# EAGLE design bsom-rs232-v002 (EAGLE 9.6.2)
Assembly variants: PROTOTYPE, PRODUCTION
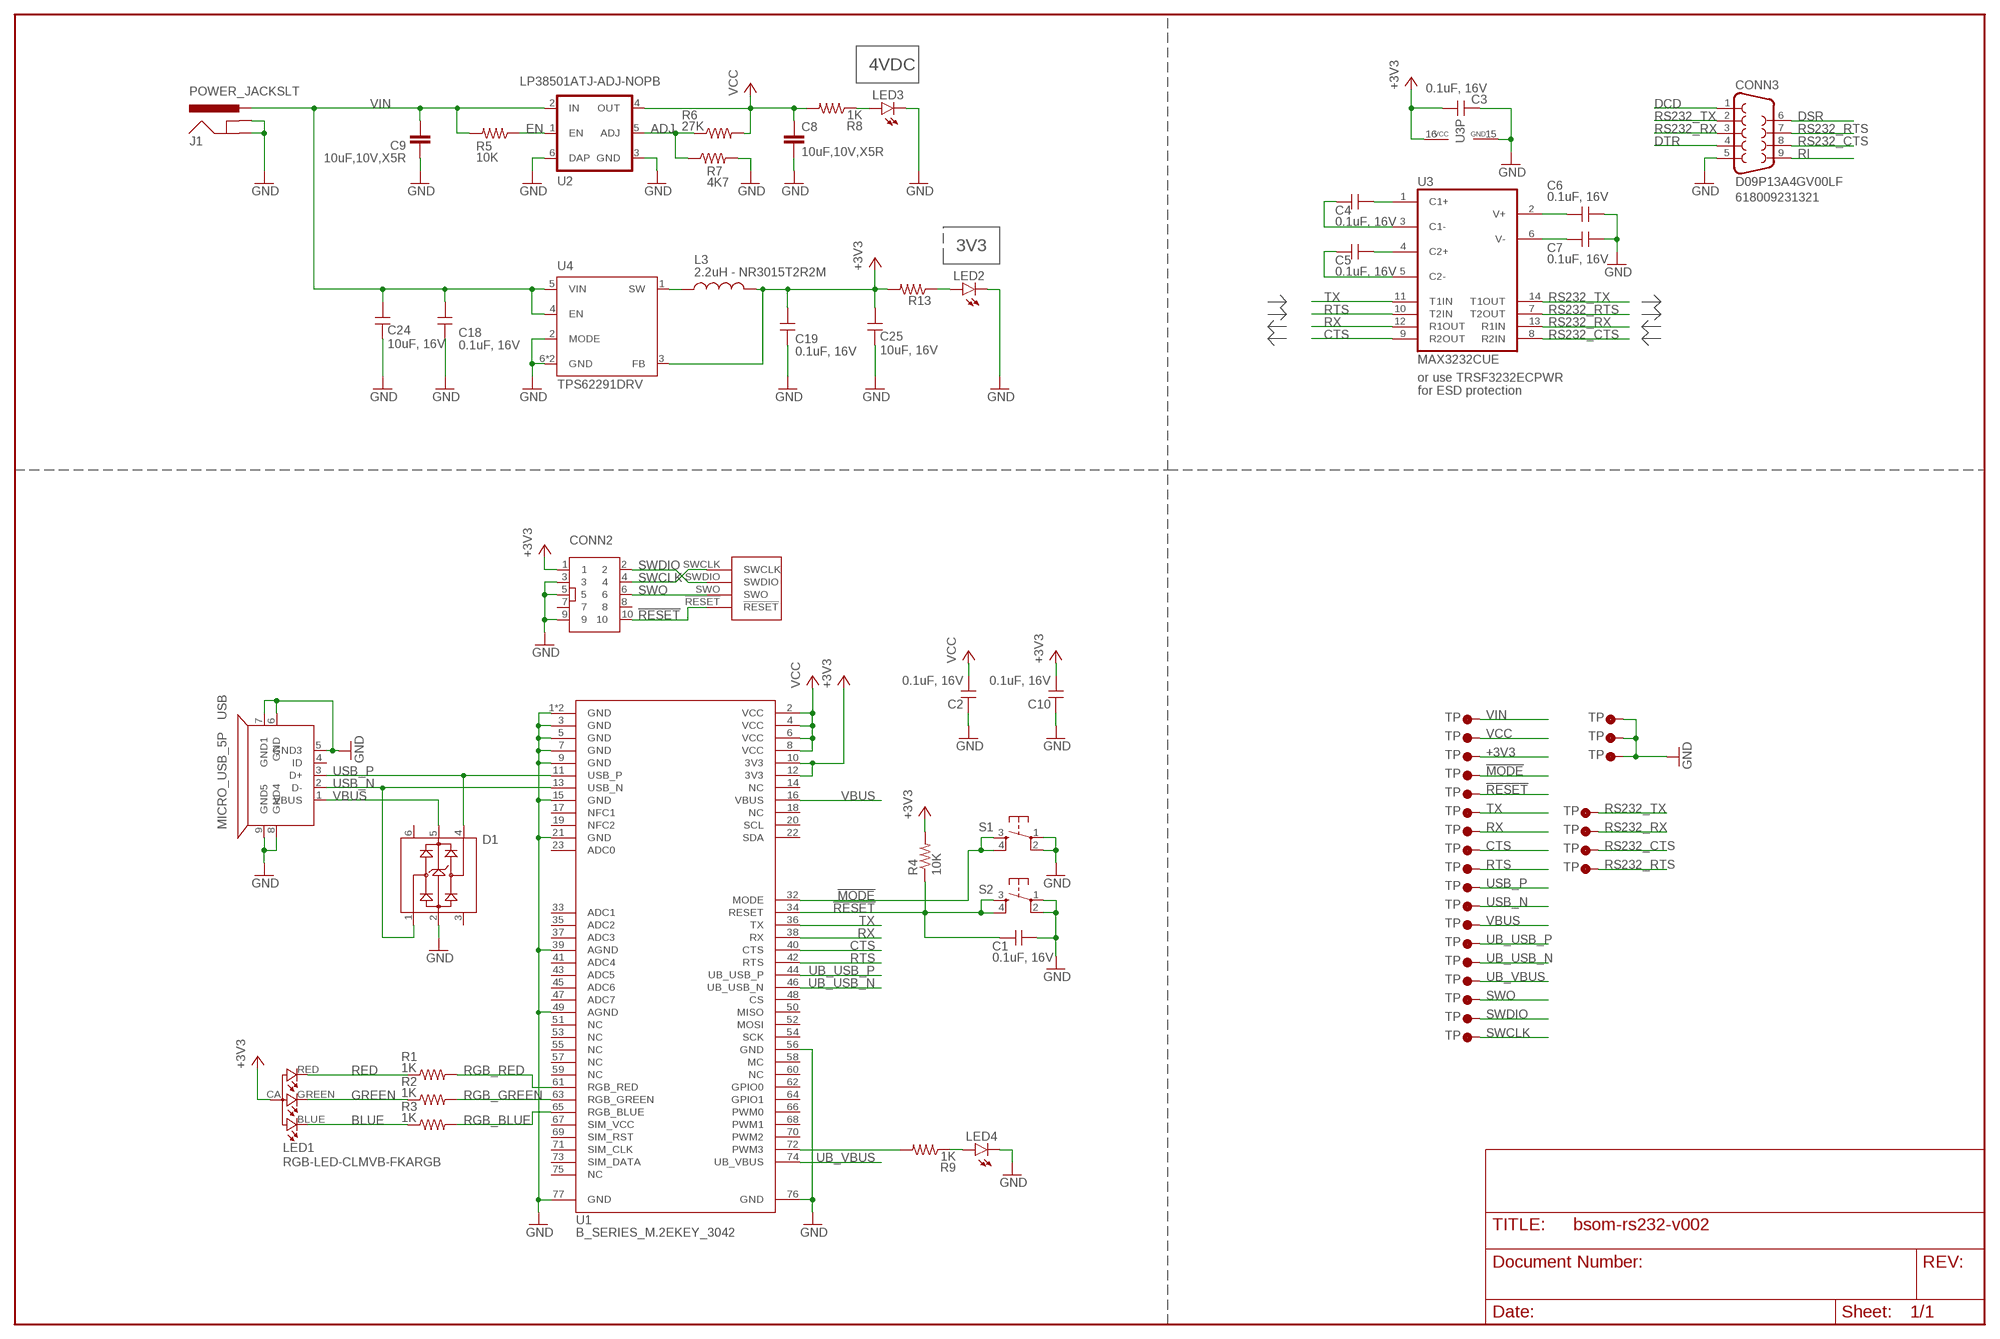
[diagram p0: schematic, sheet 1]

## Parts
C1  0.1uF, 16V  CAP_0.1UF_16V_0603  [C0603_P]  (not fitted in variant PRODUCTION)
C2  0.1uF, 16V  CAP_0.1UF_16V_0603  [C0603_P]
C3  0.1uF, 16V  CAP_0.1UF_16V_0603  [C0603_P]
C4  0.1uF, 16V  CAP_0.1UF_16V_0603  [C0603_P]
C5  0.1uF, 16V  CAP_0.1UF_16V_0603  [C0603_P]
C6  0.1uF, 16V  CAP_0.1UF_16V_0603  [C0603_P]
C7  0.1uF, 16V  CAP_0.1UF_16V_0603  [C0603_P]
C8  10uF,10V,X5R  C-EUC1206  [C1206]
C9  10uF,10V,X5R  C-EUC1206  [C1206]
C10  0.1uF, 16V  CAP_0.1UF_16V_0603  [C0603_P]
C18  0.1uF, 16V  CAP_0.1UF_16V_0603  [C0603_P]
C19  0.1uF, 16V  CAP_0.1UF_16V_0603  [C0603_P]
C24  10uF, 16V  CAP_10UF_16V_0603  [C0603_P]
C25  10uF, 16V  CAP_10UF_16V_0603  [C0603_P]
CONN2  CONN5X2  [CONN5X2_1.27]  (not fitted in variant PRODUCTION)
CONN3  D09P13A4GV00LF  F09HP  [F09HP]
D1  MAX3207EAUT+T  [SOT23-6]  (not fitted in variant PRODUCTION)
J1  POWER_JACKSLT  [POWER_JACK_SLOT]
L3  2.2uH - NR3015T2R2M  INDUCTOR-SPARKFUNNR3015T4R7M  [INDUCTOR-NR3015]
LED1  RGB-LED-CLMVB-FKARGB  [PLCC4-2MM-RGB]  (not fitted in variant PRODUCTION)
LED2  LEDCHIP-LED0603  [CHIP-LED0603]  (not fitted in variant PRODUCTION)
LED3  LEDCHIP-LED0603  [CHIP-LED0603]  (not fitted in variant PRODUCTION)
LED4  LEDCHIP-LED0603  [CHIP-LED0603]
R1  1K  RES_1K_0603  [R0603_P]  (not fitted in variant PRODUCTION)
R2  1K  RES_1K_0603  [R0603_P]  (not fitted in variant PRODUCTION)
R3  1K  RES_1K_0603  [R0603_P]  (not fitted in variant PRODUCTION)
R4  10K  RES_10K_0603  [R0603_P]  (not fitted in variant PRODUCTION)
R5  10K  RES_10K_0603  [R0603_P]
R6  27K  RES_0603  [R0603_P]
R7  4K7  RES_0603  [R0603_P]
R8  1K  RES_1K_0603  [R0603_P]  (not fitted in variant PRODUCTION)
R9  1K  RES_1K_0603  [R0603_P]
R13  RES_0603  [R0603_P]  (not fitted in variant PRODUCTION)
S1  TAC_SWITCHSMD  [TACTILE_SWITCH_SMD]  (not fitted in variant PRODUCTION)
S2  TAC_SWITCHSMD  [TACTILE_SWITCH_SMD]  (not fitted in variant PRODUCTION)
U1  B_SERIES_M.2EKEY_3042  [PARTICLE_M.2EKEY]
U2  LP38501ATJ-ADJ-NOPB  LP38501ATJ-ADJ-NOPBTI_NATIONAL_SEMICONDUCTOR_LP38501ATJ-ADJ-NOPB_0_0  [TI_NATIONAL_SEMICONDUCTOR_LP38501ATJ-ADJ-NOPB_0]
U3  MAX3232CUE  [TSSOP16]
U4  TPS62291DRV  [S-PWSON-N6]
U$1  TP5  [TP30_TOP]  (not fitted in variant PROTOTYPE)  (not fitted in variant PRODUCTION)
U$2  TP5  [TP30_TOP]  (not fitted in variant PROTOTYPE)  (not fitted in variant PRODUCTION)
U$3  TP5  [TP30_TOP]  (not fitted in variant PROTOTYPE)  (not fitted in variant PRODUCTION)
U$4  TP5  [TP30_TOP]  (not fitted in variant PROTOTYPE)  (not fitted in variant PRODUCTION)
U$5  TP5  [TP30_TOP]  (not fitted in variant PROTOTYPE)  (not fitted in variant PRODUCTION)
U$6  TP5  [TP30_TOP]  (not fitted in variant PROTOTYPE)  (not fitted in variant PRODUCTION)
U$7  TP5  [TP30_TOP]  (not fitted in variant PROTOTYPE)  (not fitted in variant PRODUCTION)
U$8  TP5  [TP30_TOP]  (not fitted in variant PROTOTYPE)  (not fitted in variant PRODUCTION)
U$9  TP5  [TP30_TOP]  (not fitted in variant PROTOTYPE)  (not fitted in variant PRODUCTION)
U$10  TP5  [TP30_TOP]  (not fitted in variant PROTOTYPE)  (not fitted in variant PRODUCTION)
U$11  TP5  [TP30_TOP]  (not fitted in variant PROTOTYPE)  (not fitted in variant PRODUCTION)
U$12  TP5  [TP30_TOP]  (not fitted in variant PROTOTYPE)  (not fitted in variant PRODUCTION)
U$13  TP5  [TP30_TOP]  (not fitted in variant PROTOTYPE)  (not fitted in variant PRODUCTION)
U$14  TP5  [TP30_TOP]  (not fitted in variant PROTOTYPE)  (not fitted in variant PRODUCTION)
U$15  TP5  [TP30_TOP]  (not fitted in variant PROTOTYPE)  (not fitted in variant PRODUCTION)
U$16  TP5  [TP30_TOP]  (not fitted in variant PROTOTYPE)  (not fitted in variant PRODUCTION)
U$17  TP5  [TP30_TOP]  (not fitted in variant PROTOTYPE)  (not fitted in variant PRODUCTION)
U$18  TP5  [TP30_TOP]  (not fitted in variant PROTOTYPE)  (not fitted in variant PRODUCTION)
U$19  TP5  [TP30_TOP]  (not fitted in variant PROTOTYPE)  (not fitted in variant PRODUCTION)
U$20  TP5  [TP30_TOP]  (not fitted in variant PROTOTYPE)  (not fitted in variant PRODUCTION)
U$21  TP5  [TP30_TOP]  (not fitted in variant PROTOTYPE)  (not fitted in variant PRODUCTION)
U$22  TP5  [TP30_TOP]  (not fitted in variant PROTOTYPE)  (not fitted in variant PRODUCTION)
U$23  TP5  [TP30_TOP]  (not fitted in variant PROTOTYPE)  (not fitted in variant PRODUCTION)
U$24  TP5  [TP30_TOP]  (not fitted in variant PROTOTYPE)  (not fitted in variant PRODUCTION)
U$25  TP5  [TP30_TOP]  (not fitted in variant PROTOTYPE)  (not fitted in variant PRODUCTION)
USB  MICRO_USB_5P  MICRO_USBMICRO_USB  [MICRO_USB]  (not fitted in variant PRODUCTION)

## Nets
!MODE: S1.3 S1.4 U1.32(MODE) U$3.P$1(TP)
!RESET: C1.1 CONN2.10 R4.1 S2.3 S2.4 U1.34(RESET) U1.!RESET U$4.P$1(TP)
+3V3: C3.2 C10.1 C19.1 C25.1 CONN2.1 L3.2 LED1.CA R4.2 R13.2 U1.10(3V3) U1.12(3V3) U3.16(VCC) U4.3(FB) U$2.P$1(TP)
ADJ: R6.1 R7.1 U2.5(ADJ)
BLUE: LED1.BLUE R3.1
CTS: U1.40(CTS) U3.9(R2OUT) U$7.P$1(TP)
DCD: CONN3.1
DSR: CONN3.6
DTR: CONN3.4
EN: R5.1 U2.1(EN)
GND: C1.2 C2.2 C3.1 C6.1 C7.1 C8.2 C9.2 C10.2 C18.2 C19.2 C24.2 C25.2 CONN2.3 CONN2.5 CONN2.9 CONN3.5 D1.2 J1.GND@1(GNDBREAK) J1.GND@2(GND) LED2.C LED3.C LED4.C R7.2 S1.1 S1.2 S2.1 S2.2 U1.1(GND) U1.3(GND) U1.5(GND) U1.7(GND) U1.9(GND) U1.15(GND) U1.21(GND) U1.39(AGND) U1.49(AGND) U1.56(GND) U1.76(GND) U1.77(GND) U1.GND U2.3(GND) U2.6(DAP) U3.15(GND) U4.2(MODE) U4.6(GND) U4.TP(GND) U$23.P$1(TP) U$24.P$1(TP) U$25.P$1(TP) USB.5(GND3) USB.6(GND) USB.7(GND1) USB.8(GND4) USB.9(GND5)
GREEN: LED1.GREEN R2.1
N$2: L3.1 U4.1(SW)
N$3: LED3.A R8.1
N$5: R9.2 U1.72(PWM3)
N$6: LED4.A R9.1
N$10: C5.1 U3.4(C2+)
N$11: C4.1 U3.1(C1+)
N$12: C4.2 U3.3(C1-)
N$13: C5.2 U3.5(C2-)
N$14: C6.2 U3.2(V+)
N$15: C7.2 U3.6(V-)
N$20: LED2.A R13.1
RED: LED1.RED R1.1
RGB_BLUE: R3.2 U1.65(RGB_BLUE)
RGB_GREEN: R2.2 U1.63(RGB_GREEN)
RGB_RED: R1.2 U1.61(RGB_RED)
RI: CONN3.9
RS232_CTS: CONN3.8 U3.8(R2IN) U$21.P$1(TP)
RS232_RTS: CONN3.7 U3.7(T2OUT) U$22.P$1(TP)
RS232_RX: CONN3.3 U3.13(R1IN) U$20.P$1(TP)
RS232_TX: CONN3.2 U3.14(T1OUT) U$19.P$1(TP)
RTS: U1.42(RTS) U3.10(T2IN) U$8.P$1(TP)
RX: U1.38(RX) U3.12(R1OUT) U$6.P$1(TP)
SWCLK: CONN2.4 U1.SWCLK U$15.P$1(TP)
SWDIO: CONN2.2 U1.SWDIO U$16.P$1(TP)
SWO: CONN2.6 U1.SWO U$17.P$1(TP)
TX: U1.36(TX) U3.11(T1IN) U$5.P$1(TP)
UB_USB_N: U1.46(UB_USB_N) U$13.P$1(TP)
UB_USB_P: U1.44(UB_USB_P) U$12.P$1(TP)
UB_VBUS: U1.74(UB_VBUS) U$18.P$1(TP)
USB_N: D1.1 U1.13(USB_N) U$10.P$1(TP) USB.2(D-)
USB_P: D1.4 U1.11(USB_P) U$9.P$1(TP) USB.3(D+)
VBUS: D1.5 U1.16(VBUS) U$11.P$1(TP) USB.1(VBUS)
VCC: C2.1 C8.1 R6.2 R8.2 U1.2(VCC) U1.4(VCC) U1.6(VCC) U1.8(VCC) U2.4(OUT) U$1.P$1(TP)
VIN: C9.1 C18.1 C24.1 J1.PWR R5.2 U2.2(IN) U4.4(EN) U4.5(VIN) U$14.P$1(TP)
Unconnected: CONN2.7 CONN2.8 D1.3 D1.6 U1.14(NC) U1.17(NFC1) U1.18(NC) U1.19(NFC2) U1.20(SCL) U1.22(SDA) U1.23(ADC0) U1.33(ADC1) U1.35(ADC2) U1.37(ADC3) U1.41(ADC4) U1.43(ADC5) U1.45(ADC6) U1.47(ADC7) U1.48(CS) U1.50(MISO) U1.51(NC) U1.52(MOSI) U1.53(NC) U1.54(SCK) U1.55(NC) U1.57(NC) U1.58(MC) U1.59(NC) U1.60(NC) U1.62(GPIO0) U1.64(GPIO1) U1.66(PWM0) U1.68(PWM1) U1.69(SIM_RST) U1.70(PWM2) U1.71(SIM_CLK) U1.73(SIM_DATA) U1.75(NC) USB.4(ID)

## Notes on the sheet
- 4VDC
- 618009231321
- 3V3
- or use TRSF3232ECPWR
  for ESD protection

## Power pins joined to a net without a drawn wire
SIM_VCC: U1.67(SIM_VCC)

## Library data of the parts
C1-C7 C10 C18 C19 = particle-studios:CAP_: Particle Capacitors; DESP: CAP CER 0.1UF 16V X7R 0603
C8 C9 = rcl:C-EU: CAPACITOR, European symbol; SPICEPREFIX: C
C24 C25 = particle-studios:CAP_: Particle Capacitors; DESP: CAP CER 10UF 16V X7R 0603
CONN2 = particle-studios:CONN5X2: 5x2 pin JTAG connector for Particle mesh dev kits; DESP: Connector 2x5pin 1.27mm pitch SMD ROHS; MFG: KAWEEI; MPN: P6014A-M2GC-030-10; PPN: PT-200714
CONN3 = con-subd:F09: SUB-D; OC_FARNELL: unknown; OC_NEWARK: unknown
D1 = particle-studios:MAX3207
J1 = Particle:POWER_JACK: Power Jack This is the standard 5.5mm barrel jack for power. The PTH is the most common, proven, reliable, footprint. The Slot footprint only works if the mill layer is transmitted to the PCB fab house so be warned. Spark Fun Electronics SKU : PRT-00119 SMT: CONN-08106 Mating wall wart : TOL-00298 (and others)
L3 = Particle:INDUCTOR-SPARKFUN: Inductors Basic Inductor/Choke - 0603 and 1206. Footprints are not proven and vary greatly between part numbers. SRN6045- 33uH, 20% 1.4A; NR3015T4R7M: 4.7uH
LED1 = particle-studios:RGB-LED-CLMVB-FKA: CREE CLMVB-FKA RGB LED 2mm x 2mm
LED2-LED4 = led:LED: LED OSRAM: - CHIPLED LG R971, LG N971, LY N971, LG Q971, LY Q971, LO R971, LY R971 LH N974, LH R974 LS Q976, LO Q976, LY Q976 LO Q996 - Hyper CHIPLED LW Q18S LB Q993, LB Q99A, LB R99A - SideLED LS A670, LO A670, LY A670, LG A670, LP A670 LB A673, LV A673, LT A673, LW A673 LH A674 LY A675 LS A676, LA A676, LO A676, LY A676, LW A676 LS A679, LY A679, LG A679 - Hyper Micro SIDELED® LS Y876, LA Y876, LO Y876, LY Y876 LT Y87S - SmartLED LW L88C, LW L88S LB L89C, LB L89S, LG L890 LS L89K, LO L89K, LY L89K LS L896, LA L896, LO L896, LY L896 - TOPLED LS T670, LO T670, LY T670, LG T670, LP T670 LSG T670, LSP T670, LSY T670, LOP T670, LYG T670 LG T671, LOG T671, LSG T671 LB T673, LV T673, LT T673, LW T673 LH T674 LS T676, LA T676, LO T676, LY T676, LB T676, LH T676, LSB T676, LW T676 LB T67C, LV T67C, LT T67C, LS T67K, LO T67K, LY T67K, LW E67C LS E67B, LA E67B, LO E67B, LY E67B, LB E67C, LV E67C, LT E67C LW T67C LS T679, LY T679, LG T679 LS T770, LO T770, LY T770, LG T770, LP T770 LB T773, LV T773, LT T773, LW T773 LH T774 LS E675, LA E675, LY E675, LS T675 LS T776, LA T776, LO T776, LY T776, LB T776 LHGB T686 LT T68C, LB T68C - Hyper Mini TOPLED® LB M676 - Mini TOPLED Santana® LG M470 LS M47K, LO M47K, LY M47K Source: http://www.osram.convergy.de LUXEON: - LUMILED® LXK2-PW12-R00, LXK2-PW12-S00, LXK2-PW14-U00, LXK2-PW14-V00 LXK2-PM12-R00, LXK2-PM12-S00, LXK2-PM14-U00 LXK2-PE12-Q00, LXK2-PE12-R00, LXK2-PE12-S00, LXK2-PE14-T00, LXK2-PE14-U00 LXK2-PB12-K00, LXK2-PB12-L00, LXK2-PB12-M00, LXK2-PB14-N00, LXK2-PB14-P00, LXK2-PB14-Q00 LXK2-PR12-L00, LXK2-PR12-M00, LXK2-PR14-Q00, LXK2-PR14-R00 LXK2-PD12-Q00, LXK2-PD12-R00, LXK2-PD12-S00 LXK2-PH12-R00, LXK2-PH12-S00 LXK2-PL12-P00, LXK2-PL12-Q00, LXK2-PL12-R00 Source: www.luxeon.com KINGBRIGHT: KA-3528ASYC Source: www.kingbright.com
R1-R3 R8 R9 = particle-studios:RES_: Particle Resistors; DESP: RES SMD 1K OHM 1% 1/10W 0603
R4 R5 = particle-studios:RES_: Particle Resistors; DESP: RES SMD 10K OHM 1% 1/10W 0603
R6 R7 R13 = particle-studios:RES_: Particle Resistors
S1 S2 = particle-studios:TAC_SWITCH: SMD Tactiile Switch
U1 = particle-studios:B_SERIES_M.2EKEY_: Particle B Series SoM 3042 M.2 Connector with E Key Width = 30mm Length = 42mm Height = 4.2mm Key = E
U2 = particle-studios:LP38501ATJ-ADJ-NOPB: PM-REG-LP38501ADJ-DAP6; MPN: LP38501ATJ-ADJ/NOPB
U3 = maxim:MAX3232*: True RS-232 Transceivers 3.0V to 5.5V, Low-Power up to 1Mbps, Using Four 0.1µF External Capacitors Source: http://pdfserv.maxim-ic.com/en/ds/MAX3222-MAX3241.pdf; MF: MAXIM; MPN: MAX3232CUE+; OC_FARNELL: 1593350; OC_NEWARK: 68K4629
U4 = particle-studios:TPS62291
U$1-U$25 = Particle:TP: Test Points of all sizes and shapes
USB = RedBear:MICRO_USB: Micro-USB

## Board
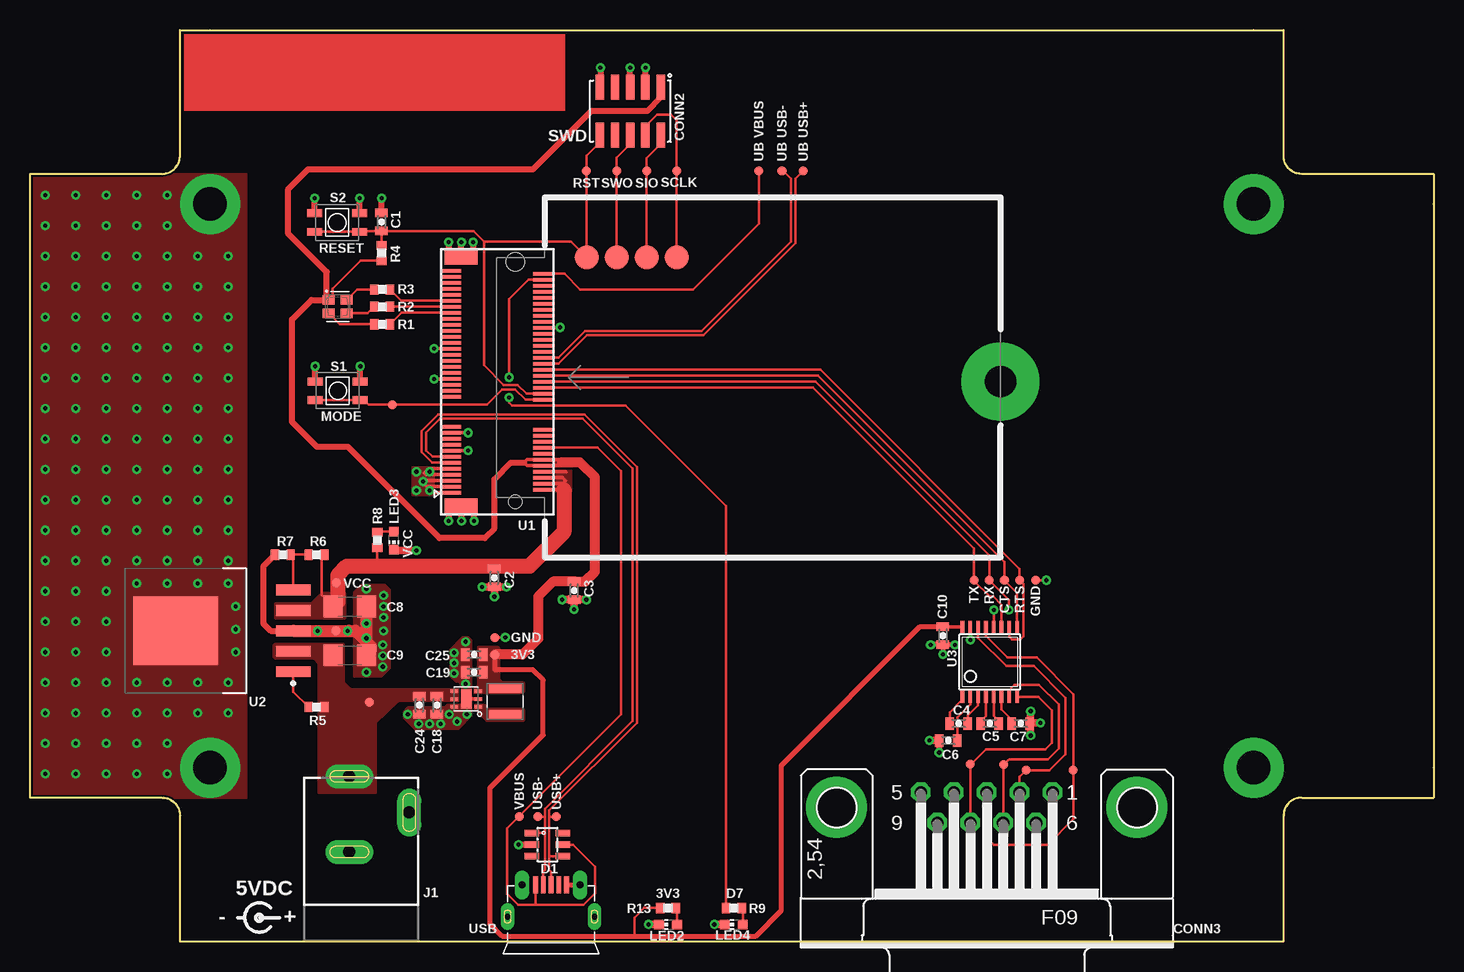
[diagram p1: board, top side]
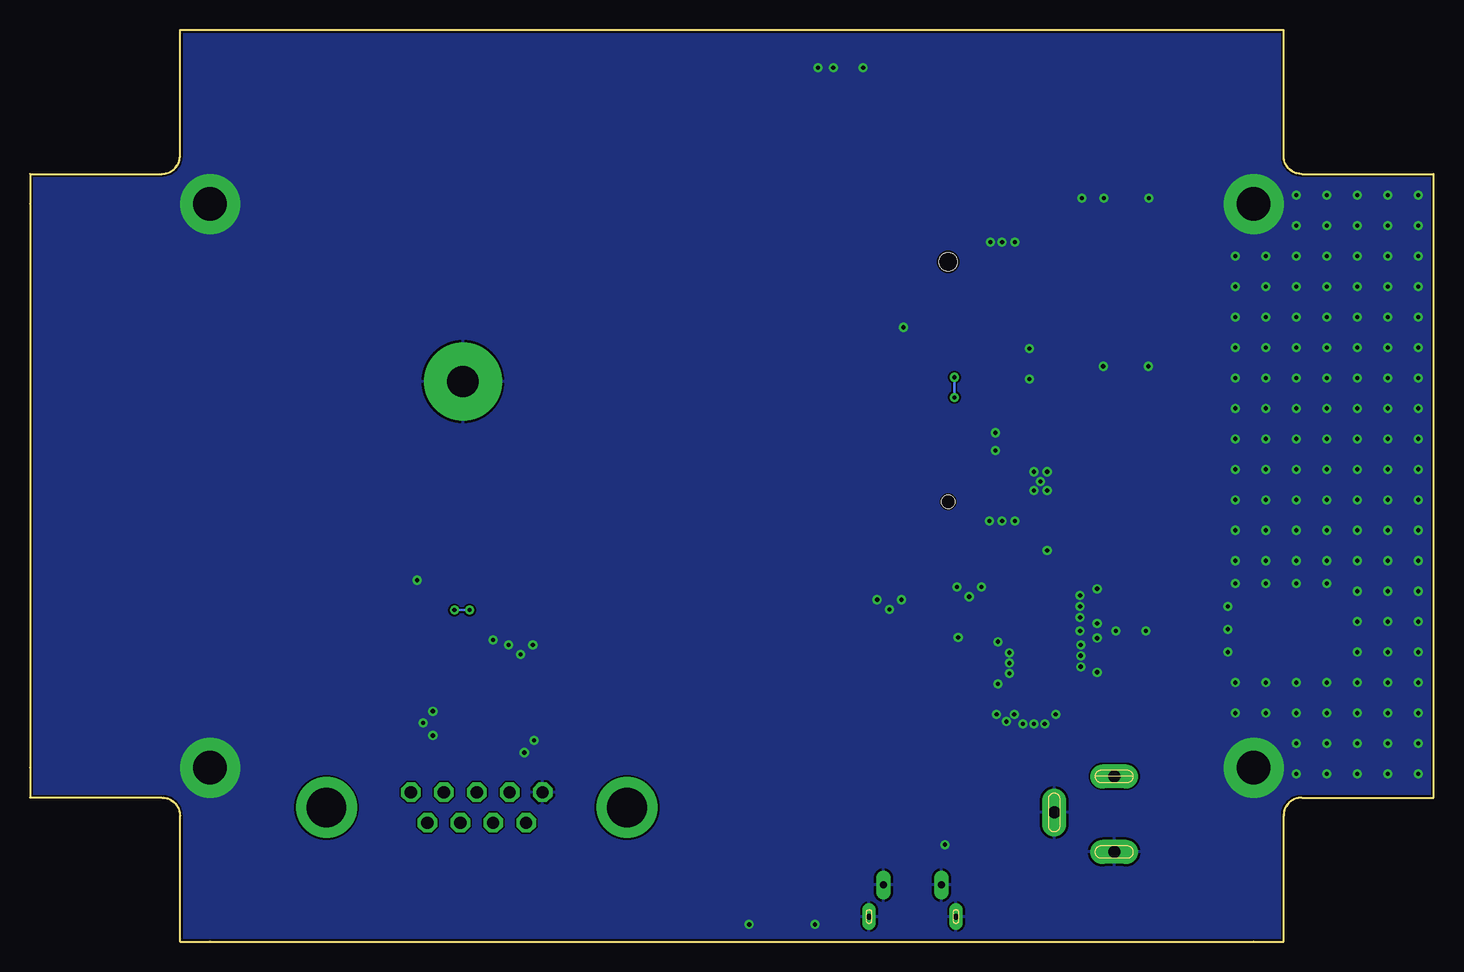
[diagram p2: board, bottom side, seen from below]

Size 117 x 76 mm. Coordinates in mm from the lower left corner, seen from the top.
Outline: 0,12 0,14.5 0,61.5 0,64 11,64 arc90 12.5,65.5 12.5,76 15,76 102,76 104.5,76 104.5,65.5 arc90 106,64 117,64 117,61.5 117,14.5 117,12 106,12 arc90 104.5,10.5 104.5,0 102,0 15,0 12.5,0 12.5,10.5 arc90 11,12 0,12
Copper layers (1*16): Top 0.035mm / dielectric 1.5mm / Bottom 0.035mm
Design rules "particle-2layer *": minimum track width 6mil, minimum drill 0.3mm, track to track 6mil, track to pad 6mil, pad to pad 6mil, via to via 6mil, smd to smd 0mil, copper to edge 6mil, drill to drill 6mil, minimum pad ring 12mil, minimum via ring 8mil, stop-mask expansion 2mil, vias tented up to drill 20mil, thermal gap 8mil

### Footprints (pad centres in the part's own frame; a part is rotated, then mirrored left to right if it is on the bottom)
C0603_P = smd 0.711 x 1.041: 1 -0.749,0; 2 0.749,0
C1206 = smd 1.6 x 1.8: 1 -1.4,0; 2 1.4,0
CONN5X2_1.27 = smd 0.7 x 2.1: 1 -2.54,-2; 2 -2.54,2; 3 -1.27,-2; 4 -1.27,2; 5 0,-2; 6 0,2; 7 1.27,-2; 8 1.27,2; 9 2.54,-2; 10 2.54,2
F09HP = drill 1.016 octagon: 1 -5.486,-1.27; 2 -2.743,-1.27; 3 0,-1.27; 4 2.743,-1.27; 5 5.486,-1.27; 6 -4.115,1.27; 7 -1.372,1.27; 8 1.372,1.27; 9 4.115,1.27 | drill 3.302 pad 5.08: G1 -12.522,0; G2 12.522,0
SOT23-6 = smd 0.55 x 1.2: 1 -0.95,-1.3; 2 0,-1.3; 3 0.95,-1.3; 4 0.95,1.3; 5 0,1.3; 6 -0.95,1.3
POWER_JACK_SLOT = drill 1 pad 2 long: GND@1 2.58,7.5; GND@2 7.58,10.8; PWR 2.58,13.8
INDUCTOR-NR3015 = smd 0.8 x 2.7: 1 -1.1,0; 2 1.1,0
PLCC4-2MM-RGB = smd 1 x 0.8: BLUE -0.75,-0.55; CA 0.75,-0.55; GREEN -0.75,0.55; RED 0.75,0.55
CHIP-LED0603 = smd 0.8 x 0.8: A 0,-0.75; C 0,0.75
R0603_P = smd 0.7 x 0.85: 1 -0.65,0; 2 0.65,0
TACTILE_SWITCH_SMD = smd 1.25 x 0.65: 1 -1.875,0.775; 2 1.875,0.775; 3 -1.875,-0.775; 4 1.875,-0.775
PARTICLE_M.2EKEY = smd 0.3 x 1.55: 1 -9.62,3.735; 2 -9.37,-3.815; 3 -9.12,3.735; 4 -8.87,-3.815; 5 -8.62,3.735; 6 -8.37,-3.815; 7 -8.12,3.735; 8 -7.87,-3.815; 9 -7.62,3.735; 10 -7.37,-3.815; 11 -7.12,3.735; 12 -6.87,-3.815; 13 -6.62,3.735; 14 -6.37,-3.815; 15 -6.12,3.735; 16 -5.87,-3.815; 17 -5.62,3.735; 18 -5.37,-3.815; 19 -5.12,3.735; 20 -4.87,-3.815; 21 -4.62,3.735; 22 -4.37,-3.815; 23 -4.12,3.735; 32 -1.87,-3.815; 33 -1.62,3.735; 34 -1.37,-3.815; 35 -1.12,3.735; 36 -0.87,-3.815; 37 -0.62,3.735; 38 -0.37,-3.815; 39 -0.12,3.735; 40 0.13,-3.815; 41 0.38,3.735; 42 0.63,-3.815; 43 0.88,3.735; 44 1.13,-3.815; 45 1.38,3.735; 46 1.63,-3.815; 47 1.88,3.735; 48 2.13,-3.815; 49 2.38,3.735; 50 2.63,-3.815; 51 2.88,3.735; 52 3.13,-3.815; 53 3.38,3.735; 54 3.63,-3.815; 55 3.88,3.735; 56 4.13,-3.815; 57 4.38,3.735; 58 4.63,-3.815; 59 4.88,3.735; 60 5.13,-3.815; 61 5.38,3.735; 62 5.63,-3.815; 63 5.88,3.735; 64 6.13,-3.815; 65 6.38,3.735; 66 6.63,-3.815; 67 6.88,3.735; 68 7.13,-3.815; 69 7.38,3.735; 70 7.63,-3.815; 71 7.88,3.735; 72 8.13,-3.815; 73 8.38,3.735; 74 8.63,-3.815; 75 8.88,3.735 | smd 1.2 x 2.75: 76 9.98,2.96; 77 -10.72,2.96 | smd 2 x 2: !RESET 10,-7.5; SWCLK 10,-15; SWDIO 10,-12.5; SWO 10,-10 | drill 2.6 pad 6.5: GND -0.351,-42 | hole 1.1: -10.37,-1.54 | hole 1.55: 9.63,-1.54
TI_NATIONAL_SEMICONDUCTOR_LP38501ATJ-ADJ-NOPB_0 = smd 2.9 x 0.9: 1 -5.95,3.4; 2 -5.95,1.7; 3 -5.95,0; 4 -5.95,-1.7; 5 -5.95,-3.4 | smd 7.1 x 5.7: 6 3.85,0
TSSOP16 = smd 0.305 x 0.991: 1 -2.275,-2.918; 2 -1.625,-2.918; 3 -0.975,-2.918; 4 -0.325,-2.918; 5 0.325,-2.918; 6 0.975,-2.918; 7 1.625,-2.918; 8 2.275,-2.918; 9 2.275,2.918; 10 1.625,2.918; 11 0.975,2.918; 12 0.325,2.918; 13 -0.325,2.918; 14 -0.975,2.918; 15 -1.625,2.918; 16 -2.275,2.918
S-PWSON-N6 = smd 0.3 x 0.6: 1 -0.65,-1; 2 0,-1; 3 0.65,-1; 4 0.65,1; 5 0,1; 6 -0.65,1 | smd 1.6 x 0.9: TP 0,0
TP30_TOP = smd 0.762 x 0.762: P$1 0,0
MICRO_USB = smd 0.4 x 1.4: 1 1.3,0.1; 2 0.65,0.1; 3 0,0.1; 4 -0.65,0.1; 5 -1.3,0.1 | drill 0.6 pad 0.75 long: 6 2.425,0.1 | drill 0.5 pad 1 long: 7 3.625,2.75; 8 -3.625,2.75 | drill 0.6 pad 0.65 long: 9 -2.425,0.1

### Placement (x,y rotation side)
C1  29.31,59.99 90 top
C2  38.71,30.33 270 top
C3  45.36,29.26 90 top
C4  77.42,18.19 0 top
C5  80.01,18.19 0 top
C6  76.56,16.76 0 top
C7  82.6,18.19 180 top
C8  26.67,27.94 0 top
C9  26.67,23.88 0 top
C10  76.1,25.5 270 top
C18  33.93,19.71 270 top
C19  37.03,22.45 180 top
C24  32.46,19.71 270 top
C25  37.03,23.93 180 top
CONN2  50.04,69.24 180 top
CONN3  79.76,11.18 180 top
D1  43.13,8.08 270 top
J1  24.04,-0.03 0 top
L3  39.62,20.02 90 top
LED1  25.65,52.93 180 top
LED2  53.19,1.42 90 top
LED3  30.33,33.43 180 top
LED4  58.67,1.42 90 top
R1  29.36,51.46 0 top
R2  29.36,52.93 0 top
R3  29.36,54.36 0 top
R4  29.31,57.4 270 top
R5  23.88,19.56 0 top
R6  23.88,32.26 0 top
R7  21.08,32.26 180 top
R8  28.96,33.48 270 top
R9  58.67,2.79 180 top
R13  53.19,2.79 180 top
S1  25.65,45.92 0 top
S2  25.6,59.94 0 top
U1  38.91,47.04 90 top
U2  16,25.91 180 top
U3  80.01,23.32 0 top
U4  36.37,20.22 90 top
U$1  25.55,29.92 90 top
U$2  38.76,23.93 90 top
U$3  30.23,44.75 90 top
U$4  46.38,64.26 90 top
U$5  78.69,30.12 90 top
U$6  79.96,30.12 90 top
U$7  81.23,30.12 90 top
U$8  82.5,30.12 90 top
U$9  43.89,10.41 90 top
U$10  42.32,10.41 90 top
U$11  40.79,10.41 90 top
U$12  64.47,64.26 90 top
U$13  62.69,64.26 90 top
U$14  28.3,19.96 90 top
U$15  53.9,64.26 90 top
U$16  51.41,64.26 90 top
U$17  48.92,64.26 90 top
U$18  60.76,64.26 0 top
U$19  83.06,14.27 90 top
U$20  86.97,14.27 90 top
U$21  78.38,14.78 90 top
U$22  81.18,14.73 90 top
U$23  25.5,25.91 90 top
U$24  83.82,30.12 90 top
U$25  38.76,25.35 90 top
USB  43.43,4.83 180 top

### Tracks (layer width: path | path; a pad name or v marks a point on that pad's centre or on a via)
!MODE
  Top 0.203: S1.3 S1.4 27.85,45.15 28.25,44.76 U$3.P$1 38.1,44.76 39.37,46.02 40.45,46.02 41.3,45.17 U1.32
!RESET
  Top 0.203: 46.41,64.41 U1.!RESET 45.08,58.37 37.85,58.37 | 46.41,64.41 46.41,65.51 47.5,66.6 CONN2.10 | S2.3 S2.4 27.55,59.24 C1.1 | U1.34 41.4,45.67 40.66,46.41 39.5,46.41 37.85,48.06 37.85,58.37 | C1.1 36.97,59.24 37.85,58.37 | U$4.P$1 46.38,64.38 46.41,64.41 | R4.1 C1.1
+3V3
  Top 0.203: C3.2 45.5,30.01 | R13.2 51.21,2.79 50.39,1.98 50.39,0.46 | R4.2 27.54,56.75 25.25,54.46 25.25,53.83 LED1.CA
  Top 0.254: 44.4,40.18 44.39,40.17 44.55,40.17 44.33,39.95 44.05,39.67
  Top 0.305: 44.39,40.17 U1.12 41.44,40.17 41.2,39.93 41.46,39.67 U1.10 44.05,39.67 | U3.16 76.11,26.23
  Top 0.406: 76.11,26.23 C10.1 74.21,26.25 62.64,14.68 62.64,2.59 60.5,0.46 50.39,0.46 39.37,0.46 38.35,1.47 38.35,12.8 42.77,17.22 42.77,21.79 41.91,22.66 38.76,22.66 U$2.P$1
  Top 0.508: CONN2.1 52.58,70.36 51.46,69.24 46.79,69.24 41.91,64.36 23.16,64.36 21.49,62.69 21.49,59.08 24.74,55.83 24.74,53.65 LED1.CA 23.46,53.48 21.84,51.87 21.84,43.33 23.93,41.25 26.52,41.25 34.14,33.63 37.9,33.63 38.71,34.44 38.71,38.56 40.08,39.93 41.2,39.93
  Top 0.813: 44.33,39.95 45.85,39.95 47.09,38.71 47.09,30.82 46.28,30.01 45.5,30.01 43.62,30.01 42.37,28.75 42.37,25.25 41.05,23.93 U$2.P$1
  pour Top (no thermals): 41.05,20.68 37.03,20.68 37.03,21.08 37.34,21.39 37.34,24.54 37.39,24.59 38.96,24.59 39.12,24.43 39.12,21.89 39.37,21.64 41.1,21.64 41.2,21.54 41.2,20.83
  pour Top: 43.84,39.57 43.84,40.28 45.16,40.28 45.16,39.57
ADJ
  Top 0.203: U2.5 21.95,32.04 R7.1 R6.1
BLUE
  Top 0.203: LED1.BLUE 27.28,54.36 R3.1
CTS
  Top 0.203: U1.40 65.7,47.17 81.23,31.64 U$7.P$1 82.28,29.07 U3.9
EN
  Top 0.203: R5.1 21.95,20.83 U2.1
GND  (via drill 0.35, 2.8 pad 5)
  Top 0.203: U$23.P$1 26.57,25.91 | U$24.P$1 v84.73,30.12 | v39.62,25.35 U$25.P$1
  Top 0.305: U4.2 U4.TP | U3.15 v78.39,25.15 v78.38,25.15 | U1.49 v33.69,49.42 v33.68,49.43 | U1.56 44.16,51.17 v44.2,51.21 | U1.21 v36.52,42.42 | U1.9 33.22,39.42 32.87,39.06 33.01,38.92 U1.7 | U1.5 33.09,38.42 32.82,38.15 33.05,37.92 | U1.3 33.05,37.92 | U1.1 33.55,37.42 33.05,37.92 | U1.15 36.52,40.92 v36.52,40.95 | U1.39 35.18,46.89 v33.68,46.89
  Top 0.406: USB.5 USB.9 | C10.2 75.09,24.75 v75.08,24.74 | C10.2 v76.1,23.93 | C10.2 77.1,24.75 v77.11,24.74
  Top 0.508: CONN2.9 47.55,71.29 v47.55,72.85 | CONN2.5 v50.04,72.85 | CONN2.3 v51.31,72.85 | S1.1 v23.78,47.95 v23.77,47.95 | S1.2 v27.53,47.95 | S2.1 v23.73,61.97 v23.72,61.98 | S2.2 v27.48,61.97 v27.48,61.98 | C1.2 v29.31,61.98 | R7.2 19.46,31.28 19.46,26.52 20.07,25.91 U2.3 | D1.2 v40.74,8.08 | v34.9,58.32 34.9,57.05 34.95,57 35.93,57 | 35.93,57 U1.76 35.95,58.3 v35.97,58.32 | v36.93,58.32 36.93,57.1 36.83,57 35.93,57 | U1.77 35.25,36.32 34.9,35.97 v34.9,35.05 | v37.03,35.05 37.03,35.87 36.51,36.39 36.02,36.39 U1.77 | U1.77 35.95,35.07 v35.97,35.05 | v75.79,15.75 75.81,15.76 C6.1
  Top 0.61: C6.1 v74.98,16.76 | C7.1 83.4,18.24 v84.23,18.24 | C7.1 83.41,18.25 v83.41,19.2 | C7.1 83.41,18.12 v83.41,17.17 | C2.2 v38.71,28.75 | C2.2 38.72,29.57 v39.73,29.57 | C2.2 37.71,29.58 v37.69,29.57 | C3.1 v45.36,27.69 | C3.1 46.37,28.51 v46.38,28.5 | C3.1 44.36,28.51 v44.35,28.5 | LED4.C v57.05,1.42 | v32.21,32.61 30.39,32.61 LED3.C | LED2.C v51.56,1.42
  Top 1.016: U2.3 26.57,25.91 27.13,25.91 28.4,24.64 28.4,24.28 28.07,24.61 C8.2
  other vias: 28.04,29.41 29.46,28.85 29.46,27.94 29.46,27.03 28.04,26.52 28.04,25.3 29.41,24.74 29.41,23.83 29.41,22.91 28.04,22.45 35.36,24.08 36.32,24.99 35.36,22.35 36.32,21.49 35.36,23.22 32.41,18.14 33.32,18.14 34.24,18.14 31.5,18.95 34.95,18.95 36.42,18.95 35.61,18.34 32.21,39.17 33.32,39.17 32.77,38.35 32.21,37.59 33.32,37.59 1.27,13.97 1.27,16.51 1.27,19.05 1.27,21.59 1.27,24.13 1.27,26.67 1.27,29.21 1.27,31.75 1.27,34.29 1.27,36.83 1.27,39.37 1.27,41.91 1.27,44.45 1.27,46.99 1.27,49.53 1.27,52.07 1.27,54.61 1.27,57.15 1.27,59.69 1.27,62.23 3.81,13.97 6.35,13.97 8.89,13.97 11.43,13.97 3.81,16.51 6.35,16.51 8.89,16.51 11.43,16.51 3.81,19.05 6.35,19.05 8.89,19.05 11.43,19.05 3.81,21.59 3.81,24.13 3.81,26.67 3.81,29.21 3.81,31.75 3.81,34.29 3.81,36.83 6.35,36.83 8.89,36.83 11.43,36.83 13.97,36.83 16.51,36.83 16.51,34.29 16.51,31.75 13.97,31.75 11.43,31.75 8.89,31.75 6.35,31.75 6.35,34.29 8.89,34.29 11.43,34.29 13.97,34.29 6.35,29.21 6.35,26.67 6.35,24.13 6.35,21.59 13.97,19.05 16.51,19.05 8.89,21.59 11.43,21.59 13.97,21.59 16.51,21.59 16.51,29.84 13.97,29.84 11.43,29.84 8.89,29.84 17.14,27.94 17.14,26.04 17.14,24.13 15,61.5 15,14.5 102,61.5 102,14.5 3.81,39.37 3.81,41.91 3.81,44.45 3.81,46.99 3.81,49.53 3.81,52.07 3.81,54.61 3.81,57.15 3.81,59.69 3.81,62.23 6.35,62.23 6.35,39.37 6.35,41.91 6.35,44.45 6.35,46.99 6.35,49.53 6.35,52.07 6.35,54.61 6.35,57.15 6.35,59.69 8.89,39.37 8.89,41.91 8.89,44.45 8.89,46.99 8.89,49.53 8.89,52.07 8.89,54.61 8.89,57.15 8.89,59.69 11.43,39.37 11.43,41.91 11.43,44.45 11.43,46.99 11.43,49.53 11.43,52.07 11.43,54.61 11.43,57.15 13.97,39.37 13.97,41.91 13.97,44.45 13.97,46.99 13.97,49.53 13.97,52.07 13.97,54.61 13.97,57.15 16.51,39.37 16.51,41.91 16.51,44.45 16.51,46.99 16.51,49.53 16.51,52.07 16.51,54.61 16.51,57.15 8.89,62.23 11.43,62.23 11.43,59.69 23.98,25.91 26.47,25.91 29.46,25.91
  pour Top (rank 2, no thermals): 36.83,18.85 36.83,25.1 36.58,25.35 36.02,25.35 35,24.33 35,22.15 35.46,21.69 35.71,21.69 35.92,21.49 35.92,19.91 35.76,19.76 34.8,19.76 34.54,19.51 31.5,19.51 31.14,19.15 31.14,18.64 32.05,17.73 35.71,17.73
  pour Top (no thermals): 27.03,22.05 27.03,29.16 27.64,29.77 29.57,29.77 29.97,29.36 29.97,22.76 29.26,22.05
  pour Top: 33.68,37.24 33.68,39.52 31.85,39.52 31.85,37.24 33.63,37.24
  pour Bottom: 0,0 0,76 117,76 117,0
  pour Top (no thermals): 0,12 0,64 18,64 18,12
GREEN
  Top 0.203: LED1.GREEN 28.16,52.38 R2.1
N$2
  pour Top (no thermals): 37.08,19.76 37.85,19.76 38.15,19.46 41.05,19.46 41.2,19.3 41.2,18.44 41.1,18.34 38.1,18.34 37.08,19.35
N$3
  Top 0.203: LED3.A 29,34.18 R8.1
N$5  (via drill 0.35)
  Top 0.203: v39.93,45.36 39.93,44.96 40.18,44.7 49.63,44.7 58.02,36.31 R9.2 | v39.93,47.04 39.93,53.54 41.56,55.17 U1.72
  Bottom 0.203: v39.93,45.36 v39.93,47.04
N$6
  Top 0.203: LED4.A 59.42,2.69 R9.1
N$10
  Top 0.203: U3.4 79.69,18.83 79.26,18.4 C5.1
N$11
  Top 0.203: U3.1 77.73,20.18 76.67,19.11 C4.1
N$12
  Top 0.203: U3.3 79.03,19.7 78.17,18.83 C4.2
N$13
  Top 0.203: U3.5 80.33,18.83 80.76,18.4 C5.2
N$14
  Top 0.203: U3.2 78.39,19.76 77.31,18.68 C6.2
N$15
  Top 0.203: U3.6 80.98,19.34 81.85,18.48 C7.2
N$20
  Top 0.203: LED2.A 53.94,2.69 R13.1
RED
  Top 0.203: LED1.RED 25.83,51.46 R1.1
RGB_BLUE
  Top 0.203: U1.65 30.96,53.42 30.02,54.36 R3.2
RGB_GREEN
  Top 0.203: U1.63 30.02,52.92 R2.2
RGB_RED
  Top 0.203: U1.61 30.97,52.42 R1.2
RS232_CTS
  Top 0.203: CONN3.8 78.38,14.68 78.49,14.78 | U3.8 84.05,20.4 85.19,19.25 85.19,16.56 84.63,16 79.7,16 78.66,14.96 78.49,14.78 | U$21.P$1 78.49,14.78
RS232_RTS
  Top 0.203: U3.7 81.64,20.98 82.04,21.39 84.12,21.39 85.75,19.76 85.75,16.1 84.84,15.19 81.64,15.19 81.53,15.09 U$22.P$1 81.13,14.68 CONN3.7
RS232_RX
  Top 0.203: U3.13 79.69,25.47 81.48,23.67 83.92,23.67 86.97,20.62 86.97,14.58 U$20.P$1 86.97,10.21 84.84,8.08 80.37,8.08 79.76,8.69 CONN3.3
RS232_TX
  Top 0.203: CONN3.2 82.5,13.72 U$19.P$1 84.99,14.28 86.31,15.6 86.31,20.32 83.67,22.96 81.38,22.96 79.03,25.31 U3.14
RTS
  Top 0.203: U1.42 65.91,47.67 82.5,31.08 U$8.P$1 82.8,29.82 82.8,25.45 82.55,25.2 81.84,25.2 81.64,25.4 U3.10
RX  (via drill 0.35)
  Top 0.203: U1.38 65.49,46.67 79.96,32.2 U$6.P$1 81.62,28.47 v81.62,27.64 | v80.35,27.64 80.35,26.25 U3.12
  Bottom 0.203: v81.62,27.64 v80.35,27.64
SWCLK
  Top 0.203: U1.SWCLK 53.91,64.28 | CONN2.4 51.31,67.97 52.27,68.94 53.44,68.94 53.91,68.46 53.91,64.77 53.91,64.28 | U$15.P$1 53.91,64.28
SWDIO
  Top 0.203: U1.SWDIO U$16.P$1 | CONN2.2 52.58,66.5 51.41,65.33 51.41,64.62 U$16.P$1 | U$16.P$1
SWO
  Top 0.203: U1.SWO U$17.P$1 | CONN2.6 50.04,66.5 48.91,65.37 48.91,64.57 U$17.P$1 | U$17.P$1
TX
  Top 0.203: U1.36 65.28,46.17 78.69,32.77 U$5.P$1 78.69,30.07 80.01,28.75 80.31,28.75 80.98,28.08 U3.11
UB_USB_N
  Top 0.203: U1.46 44.05,48.67 46.28,50.9 55.98,50.9 63.45,58.37 63.45,63.6 62.74,64.31 U$13.P$1
UB_USB_P
  Top 0.203: U1.44 44.05,48.17 46.43,50.55 56.13,50.55 63.8,58.22 63.8,63.6 U$12.P$1
UB_VBUS
  Top 0.203: U1.74 44.56,55.67 45.87,54.36 55.27,54.36 60.76,59.84 U$18.P$1
USB_N
  Top 0.203: USB.2 42.78,5.83 42.93,5.98 42.93,9.04 | U1.13 33.54,40.42 33.02,40.95 33.02,42.42 34.19,43.59 46.08,43.59 50.24,39.42 50.24,18.39 42.93,11.07 42.93,10.41 | 42.93,9.04 42.93,10.41 | D1.1 41.84,9.04 42.93,9.04 | U$10.P$1 42.93,10.41
USB_P
  Top 0.203: USB.3 43.43,5.83 43.29,5.98 43.29,7.11 | U1.11 33.54,39.92 32.66,40.8 32.66,42.56 34.04,43.94 46.22,43.94 50.6,39.57 50.6,18.24 43.29,10.93 43.29,10.41 | 43.29,7.11 43.29,10.41 | D1.4 44.41,7.11 43.29,7.11 | U$9.P$1 43.29,10.41
VBUS
  Top 0.203: U1.16 47.32,41.17 49.28,39.22 49.28,18.95 40.79,10.46 | 40.79,10.46 39.78,9.45 39.78,3.96 40.69,3.05 42.11,3.05 | U$11.P$1 40.79,10.46 | D1.5 45.26,8.08 47.09,6.25 47.09,4.01 46.13,3.05 42.11,3.05 | USB.1 42.13,3.07 42.11,3.05
VCC
  Top 0.203: R6.2 24.32,32.05 24.32,28.91 24.86,28.36 24.86,28.35 C8.1 | R8.2 28.96,31.29 | C2.1 38.71,31.29 39,31.29
  Top 0.254: 44.65,39.17 44.7,39.12 | 44.39,38.67 44.65,38.41 44.42,38.17
  Top 0.305: U1.8 44.65,39.17 | U1.6 44.39,38.67 | U1.4 44.42,38.17 | U1.2 44.5,37.67
  Top 0.813: U$1.P$1 25.55,28.22 C8.1
  Top 1.27: C8.1 25.68,28.35 25.68,30.55 26.42,31.29 28.96,31.29 39,31.29 41.66,31.29 44.5,34.14 44.5,37.67
  pour Top (no thermals): 26.16,26.97 20.47,26.97 20.47,28.14 23.47,28.14 24.18,28.85 24.33,29.01 26.21,29.01 26.21,26.97
  pour Top: 43.89,37.49 43.89,39.27 45.11,39.27 45.11,37.49
VIN
  pour Top (no thermals): 35.71,20.02 31.8,20.02 31.75,20.07 31.75,20.93 31.9,21.08 35.71,21.08
  pour Top (no thermals): 24.08,12.37 24.08,23.16 23.67,23.57 20.42,23.57 20.32,23.67 20.32,24.74 20.42,24.84 26.11,24.84 26.16,24.79 26.16,21.66 26.74,21.08 32.28,21.08 32.28,20.01 30.7,20.01 28.82,18.21 28.82,12.37
(copper drawn outside any net)
  shapes: Top area x1

### Text on the board
tPlace: SWD | UB VBUS | UB USB- | UB USB+ | RST | SWO | SIO | SCLK | RESET | MODE | VCC | VCC | TX | RX | CTS | RTS | GND | GND | 3V3 | VBUS | USB- | USB+ | 5VDC | 3V3 | D7 | - | +
tStop: B SERIES TO RS232 BRIDGE | v0.0.1 OCT 2020 / PARTICLE.IO